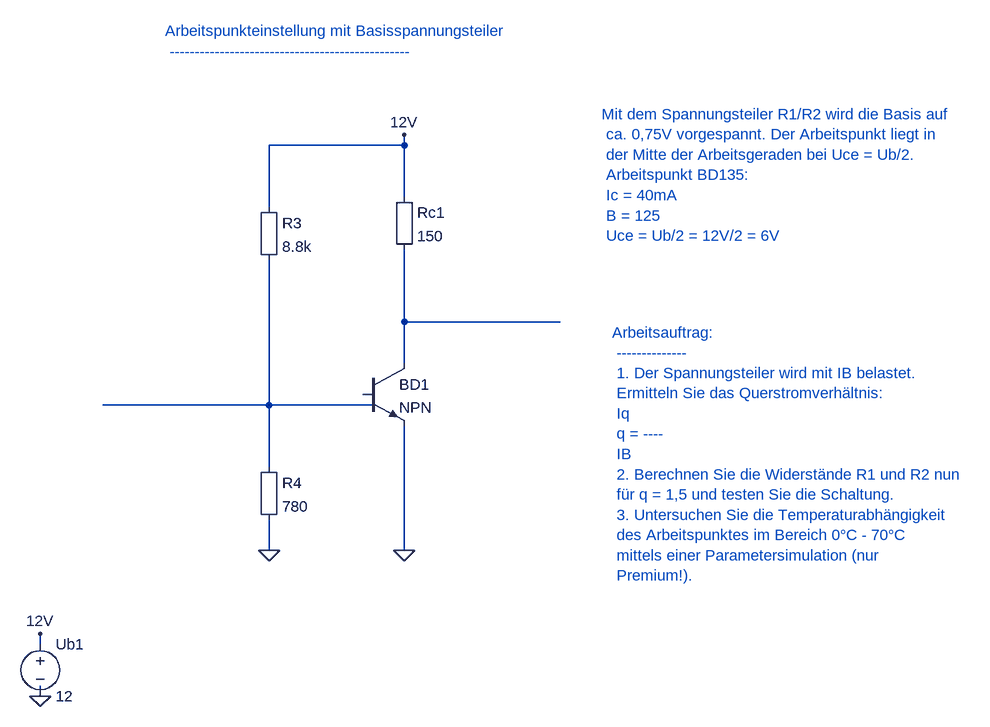
[diagram p0: schematic 9_1_3_1_Arbeitspunktstabilisierung.asc]
9_1_3_1_Arbeitspunktstabilisierung.asc, the LTspice schematic file:
Version 4
SHEET 1 880 680
WIRE 48 1072 48 1056
WIRE 544 608 560 608
WIRE 560 608 560 624
WIRE 608 656 608 688
WIRE 48 992 48 976
WIRE 608 688 608 848
WIRE 608 384 608 496
WIRE 608 304 608 224
WIRE 400 320 400 224
WIRE 400 224 608 224
WIRE 400 624 560 624
WIRE 400 400 400 624
WIRE 400 720 400 624
WIRE 400 848 400 800
WIRE 608 496 608 560
WIRE 848 496 608 496
WIRE 144 624 400 624
WIRE 608 224 608 208
FLAG 608 848 0
FLAG 48 1072 0
FLAG 400 848 0
FLAG 608 848 0
FLAG 48 1072 0
FLAG 400 848 0
FLAG 608 208 12V
FLAG 48 976 12V
SYMBOL voltage 48 976 R0
SYMATTR InstName Ub1
SYMATTR Value 12
SYMBOL npn 544 560 R0
SYMATTR InstName BD1
SYMATTR Value NPN
SYMBOL Misc\EuropeanResistor 384 304 R0
SYMATTR InstName R3
SYMATTR Value 8.8k
SYMBOL Misc\EuropeanResistor 592 288 R0
SYMATTR InstName Rc1
SYMATTR Value 150
SYMBOL Misc\EuropeanResistor 384 704 R0
SYMATTR InstName R4
SYMATTR Value 780
TEXT 240 48 Left 2 ;Arbeitspunkteinstellung mit Basisspannungsteiler \n ------------------------------------------------
TEXT 928 512 Left 2 ;Arbeitsauftrag: \n -------------- \n 1. Der Spannungsteiler wird mit IB belastet. \n Ermitteln Sie das Querstromverhältnis: \n Iq \n q = ---- \n IB \n 2. Berechnen Sie die Widerstände R1 und R2 nun \n für q = 1,5 und testen Sie die Schaltung. \n 3. Untersuchen Sie die Temperaturabhängigkeit \n des Arbeitspunktes im Bereich 0°C - 70°C \n mittels einer Parametersimulation (nur \n Premium!).
TEXT 912 176 Left 2 ;Mit dem Spannungsteiler R1/R2 wird die Basis auf \n ca. 0,75V vorgespannt. Der Arbeitspunkt liegt in \n der Mitte der Arbeitsgeraden bei Uce = Ub/2. \n Arbeitspunkt BD135: \n Ic = 40mA \n B = 125 \n Uce = Ub/2 = 12V/2 = 6V

The netlist it stands for:
* 9_1_3_1_Arbeitspunktstabilisierung.asc
V§Ub1 12V 0 12
Q§BD1 N002 N001 0 0 NPN
R3 12V N001 8.8k
Rc1 12V N002 150
R4 N001 0 780
.model NPN NPN
.model PNP PNP
.lib standard.bjt
* Arbeitspunkteinstellung mit Basisspannungsteiler
*  ------------------------------------------------
* Arbeitsauftrag:
*  --------------
*  1. Der Spannungsteiler wird mit IB belastet.
*  Ermitteln Sie das Querstromverhältnis:
*  Iq
*  q = ----
*  IB
*  2. Berechnen Sie die Widerstände R1 und R2 nun
*  für q = 1,5 und testen Sie die Schaltung.
*  3. Untersuchen Sie die Temperaturabhängigkeit
*  des Arbeitspunktes im Bereich 0°C - 70°C
*  mittels einer Parametersimulation (nur
*  Premium!).
* Mit dem Spannungsteiler R1/R2 wird die Basis auf
*  ca. 0,75V vorgespannt. Der Arbeitspunkt liegt in
*  der Mitte der Arbeitsgeraden bei Uce = Ub/2.
*  Arbeitspunkt BD135:
*  Ic = 40mA
*  B = 125
*  Uce = Ub/2 = 12V/2 = 6V
.backanno
.end